# EAGLE design Power Breakouts (EAGLE 6.6.0)
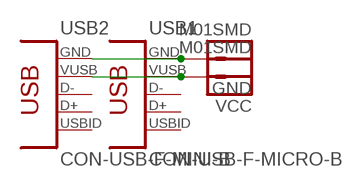
[diagram p0: schematic, sheet 1]

## Parts
GND  M01SMD  [LUXEON-PAD]
USB1  CON-USB-F-MICRO-B  [CONN_USB_MICRO-B]
USB2  CON-USB-F-MINI-B  [CONN_USB_MINI-B]
VCC  M01SMD  [LUXEON-PAD]

## Nets
N$4: GND.P$1 USB1.P5(GND) USB2.GND
N$5: USB1.P1(VUSB) USB2.VUSB VCC.P$1
Unconnected: USB1.BODY@1(BODY) USB1.BODY@2(BODY) USB1.BODY@3(BODY) USB1.BODY@4(BODY) USB1.P2(D-) USB1.P3(D+) USB1.P4(USBID) USB2.BODY@1(BODY) USB2.BODY@2(BODY) USB2.BODY@3(BODY) USB2.BODY@4(BODY) USB2.D+ USB2.D- USB2.ID(USBID)

## Library data of the parts
GND VCC = SparkFun-Connectors:M01: Header 1 Standard 1-pin 0.1" header. Use with straight break away headers (SKU : PRT-00116), right angle break away headers (PRT-00553), swiss pins (PRT-00743), machine pins (PRT-00117), and female headers (PRT-00115).
USB1 USB2 = Dangerous_Prototypes_devices:CON-USB-F: USB Female connector

## Board
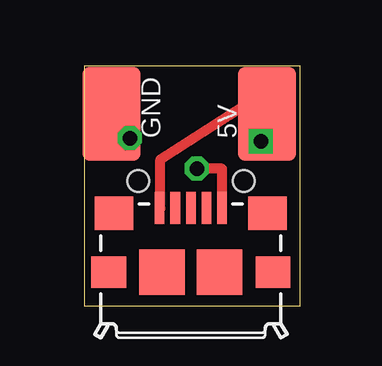
[diagram p1: board, top side]
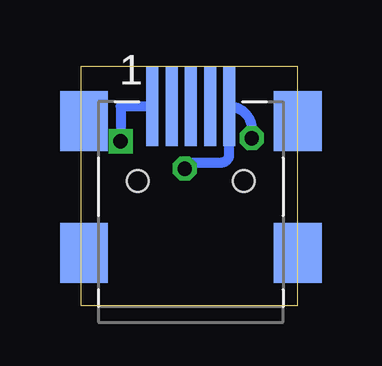
[diagram p2: board, bottom side, seen from below]

Size 9 x 10 mm. Coordinates in mm from the lower left corner, seen from the top.
Outline: 0,0 9,0 9,10 0,10 0,0
Copper layers (1*16): Top 0.035mm / dielectric 1.5mm / Bottom 0.035mm
Design rules "default": minimum track width 10mil, minimum drill 24mil, track to track 8mil, track to pad 8mil, pad to pad 8mil, via to via 8mil, smd to smd 8mil, copper to edge 40mil, drill to drill 8mil, minimum pad ring 10mil, minimum via ring 8mil, stop-mask expansion 4mil, vias tented up to drill 0mil, thermal gap 10mil

### Footprints (pad centres in the part's own frame; a part is rotated, then mirrored left to right if it is on the bottom)
LUXEON-PAD = smd 3.9 x 2.4: P$1 0,0
CONN_USB_MICRO-B = smd 1.6 x 1.4: BODY@1 -3.2,2.45; BODY@2 3.2,2.45 | smd 1.45 x 1.3: BODY@3 3.425,0; BODY@6 -3.425,0 | smd 1.9 x 1.9: BODY@4 1.2,0; BODY@5 -1.2,0 | smd 0.4 x 1.35: P1 -1.3,2.675; P2 -0.65,2.675; P3 0,2.675; P4 0.65,2.675; P5 1.3,2.675
CONN_USB_MINI-B = smd 2 x 2.5: BODY@1 -4.45,2.5; BODY@2 4.45,2.5; BODY@3 4.45,-3; BODY@4 -4.45,-3 | smd 0.5 x 3.3: D+ 0,3.1; D- -0.8,3.1; GND 1.6,3.1; ID 0.8,3.1; VUSB -1.6,3.1 | hole 0.9: -2.2,0; 2.2,0

### Placement (x,y rotation side)
GND  1.14,8 90 top
USB1  4.45,1.4 0 top
USB2  4.45,5.21 0 bottom
VCC  7.62,8 90 top

### Tracks (layer width: path | path; a pad name or v marks a point on that pad's centre or on a via)
N$4  (via drill 0.6)
  Top 0.406: USB1.P5 5.75,5.71 v4.7,5.71 | v1.91,6.99 arc-90 1.14,7.75 GND.P$1
  Bottom 0.406: v4.7,5.71 4.7,5.97 3.17,5.97 arc-90 2.85,6.3 USB2.GND arc90 1.91,7.37 v1.91,6.99
N$5  (via drill 0.6)
  Top 0.406: v7.37,6.86 7.62,6.86 VCC.P$1 6.6,8.31 3.17,6.1 3.17,4.07 USB1.P1
  Bottom 0.406: USB2.VUSB 7.37,8.31 v7.37,6.86

### Text on the board
tPlace: GND | 5V